# EasyEDA Pro project modern-cadet-v2.eprj, schematic Control board

## Sheets
1 Left Matrix: Board Name: Keyboard; Create Date: 2025-07-12; Page Name: Left Matrix; Project Name: modern-cadet-v2; Schematic Name: Control board; Update Date: 2025-07-12; Company: EasyEDA.com; Page Size: A4; Version: V1.0
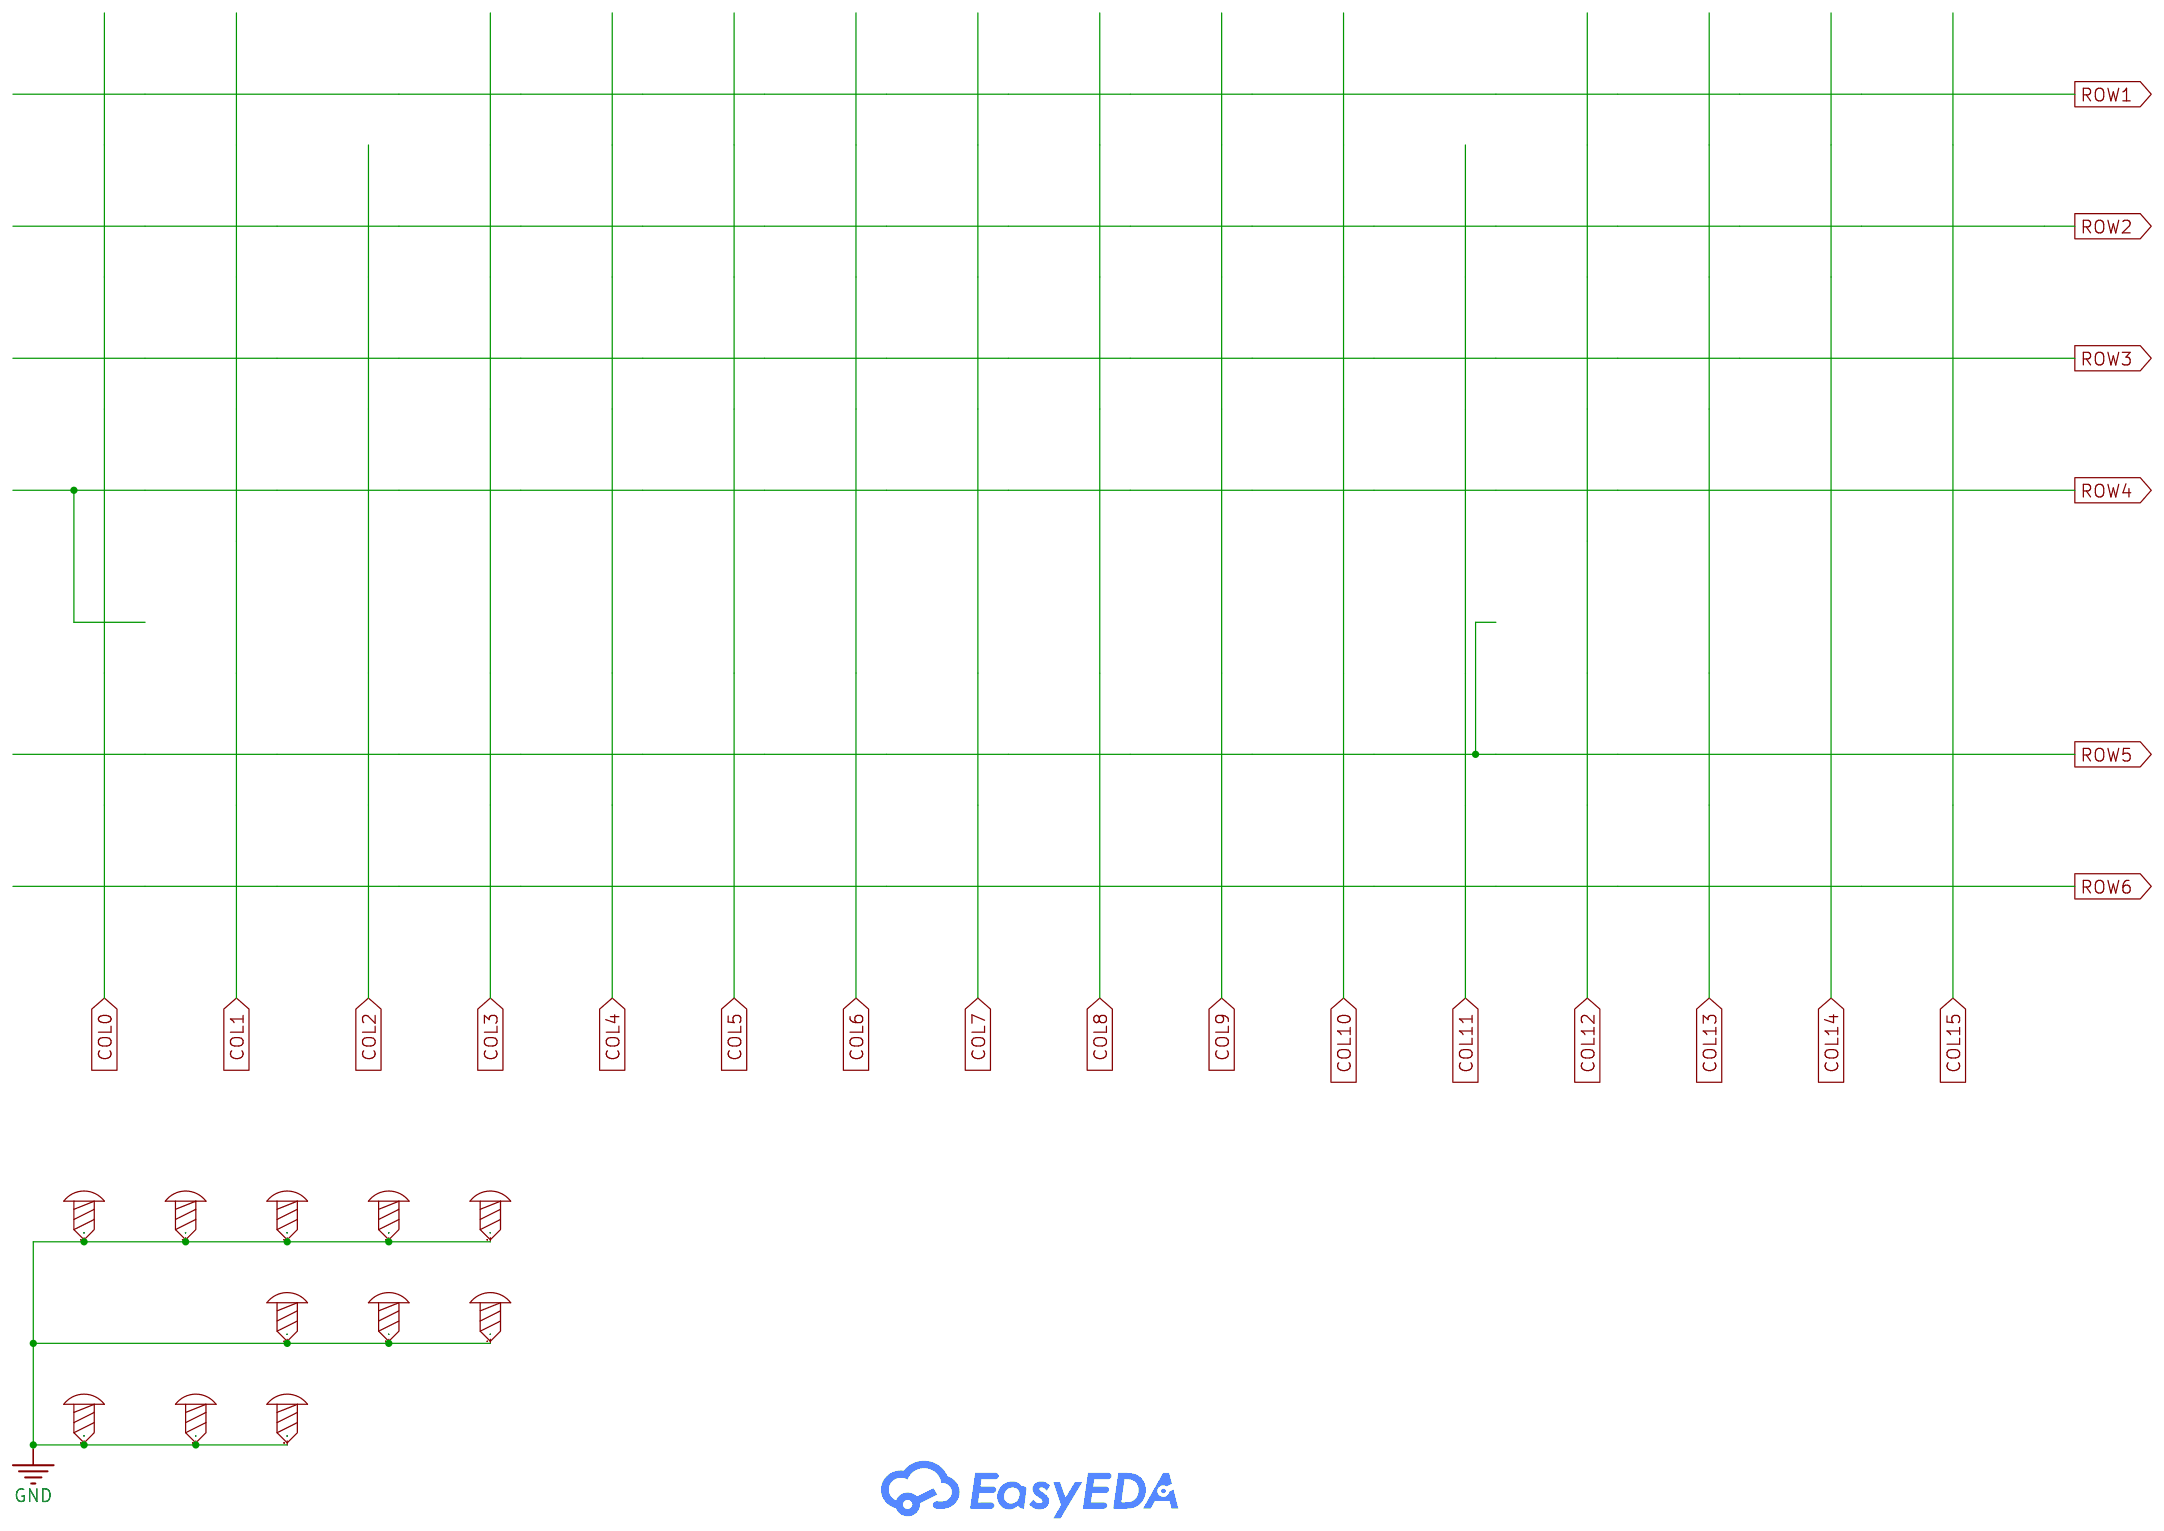
[diagram p0: Left Matrix]
2 Right Matrix: Page Name: Right Matrix
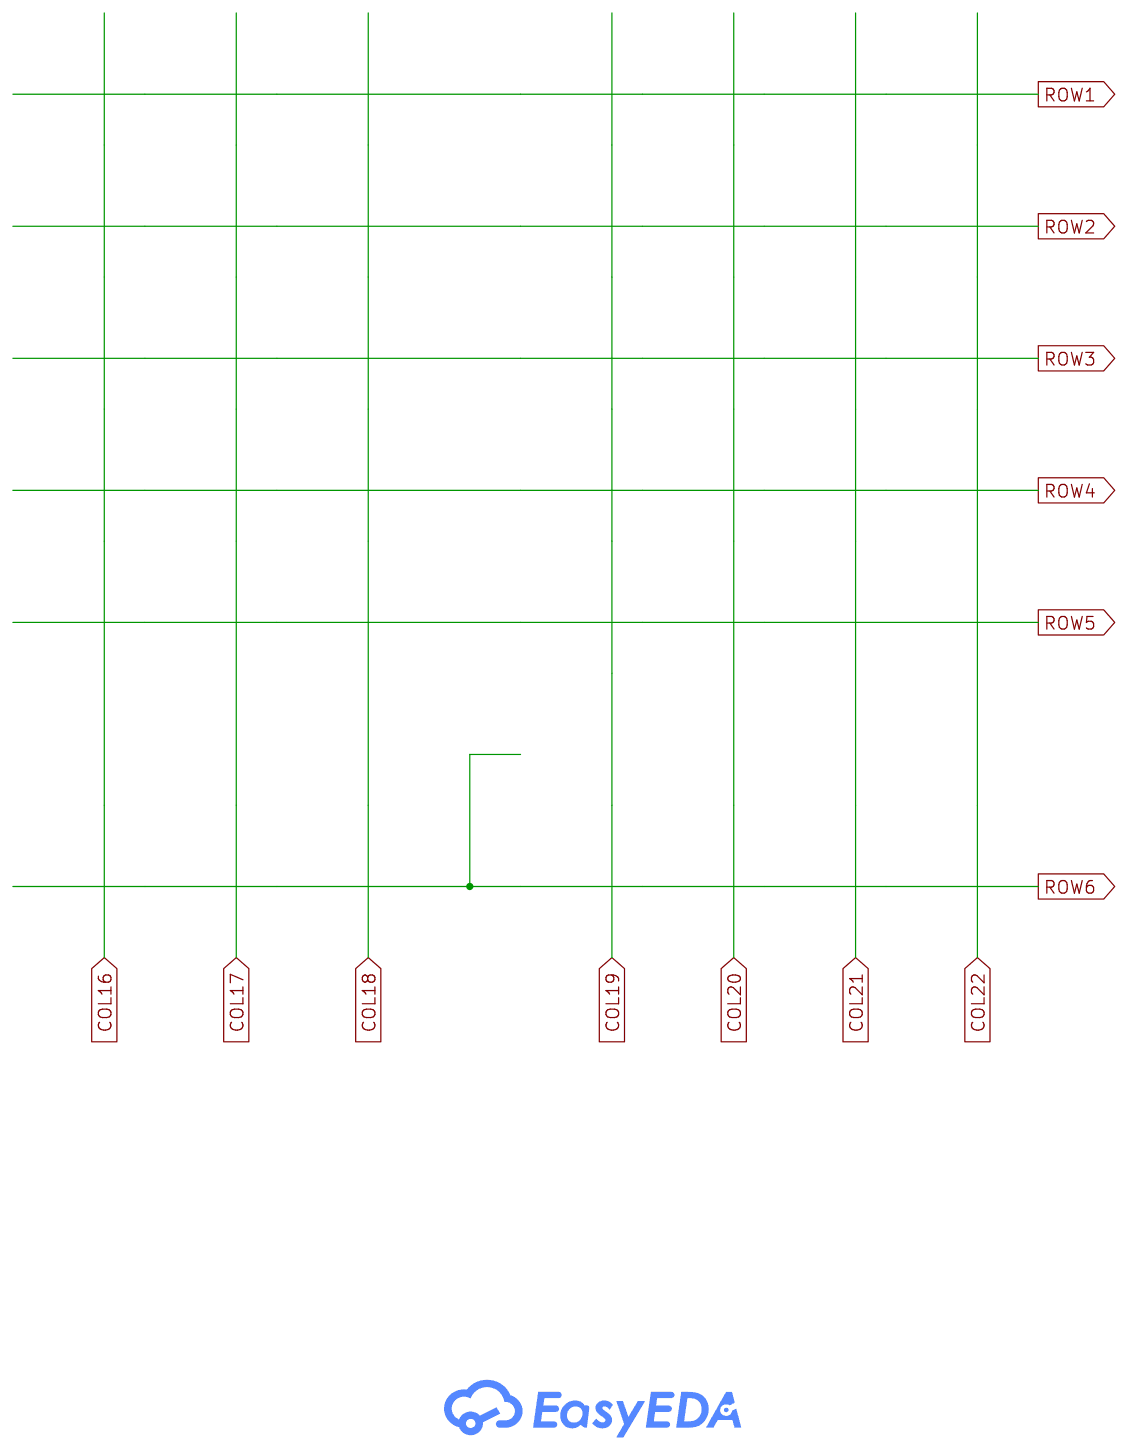
[diagram p1: Right Matrix]
3 Controller: Page Name: Controller
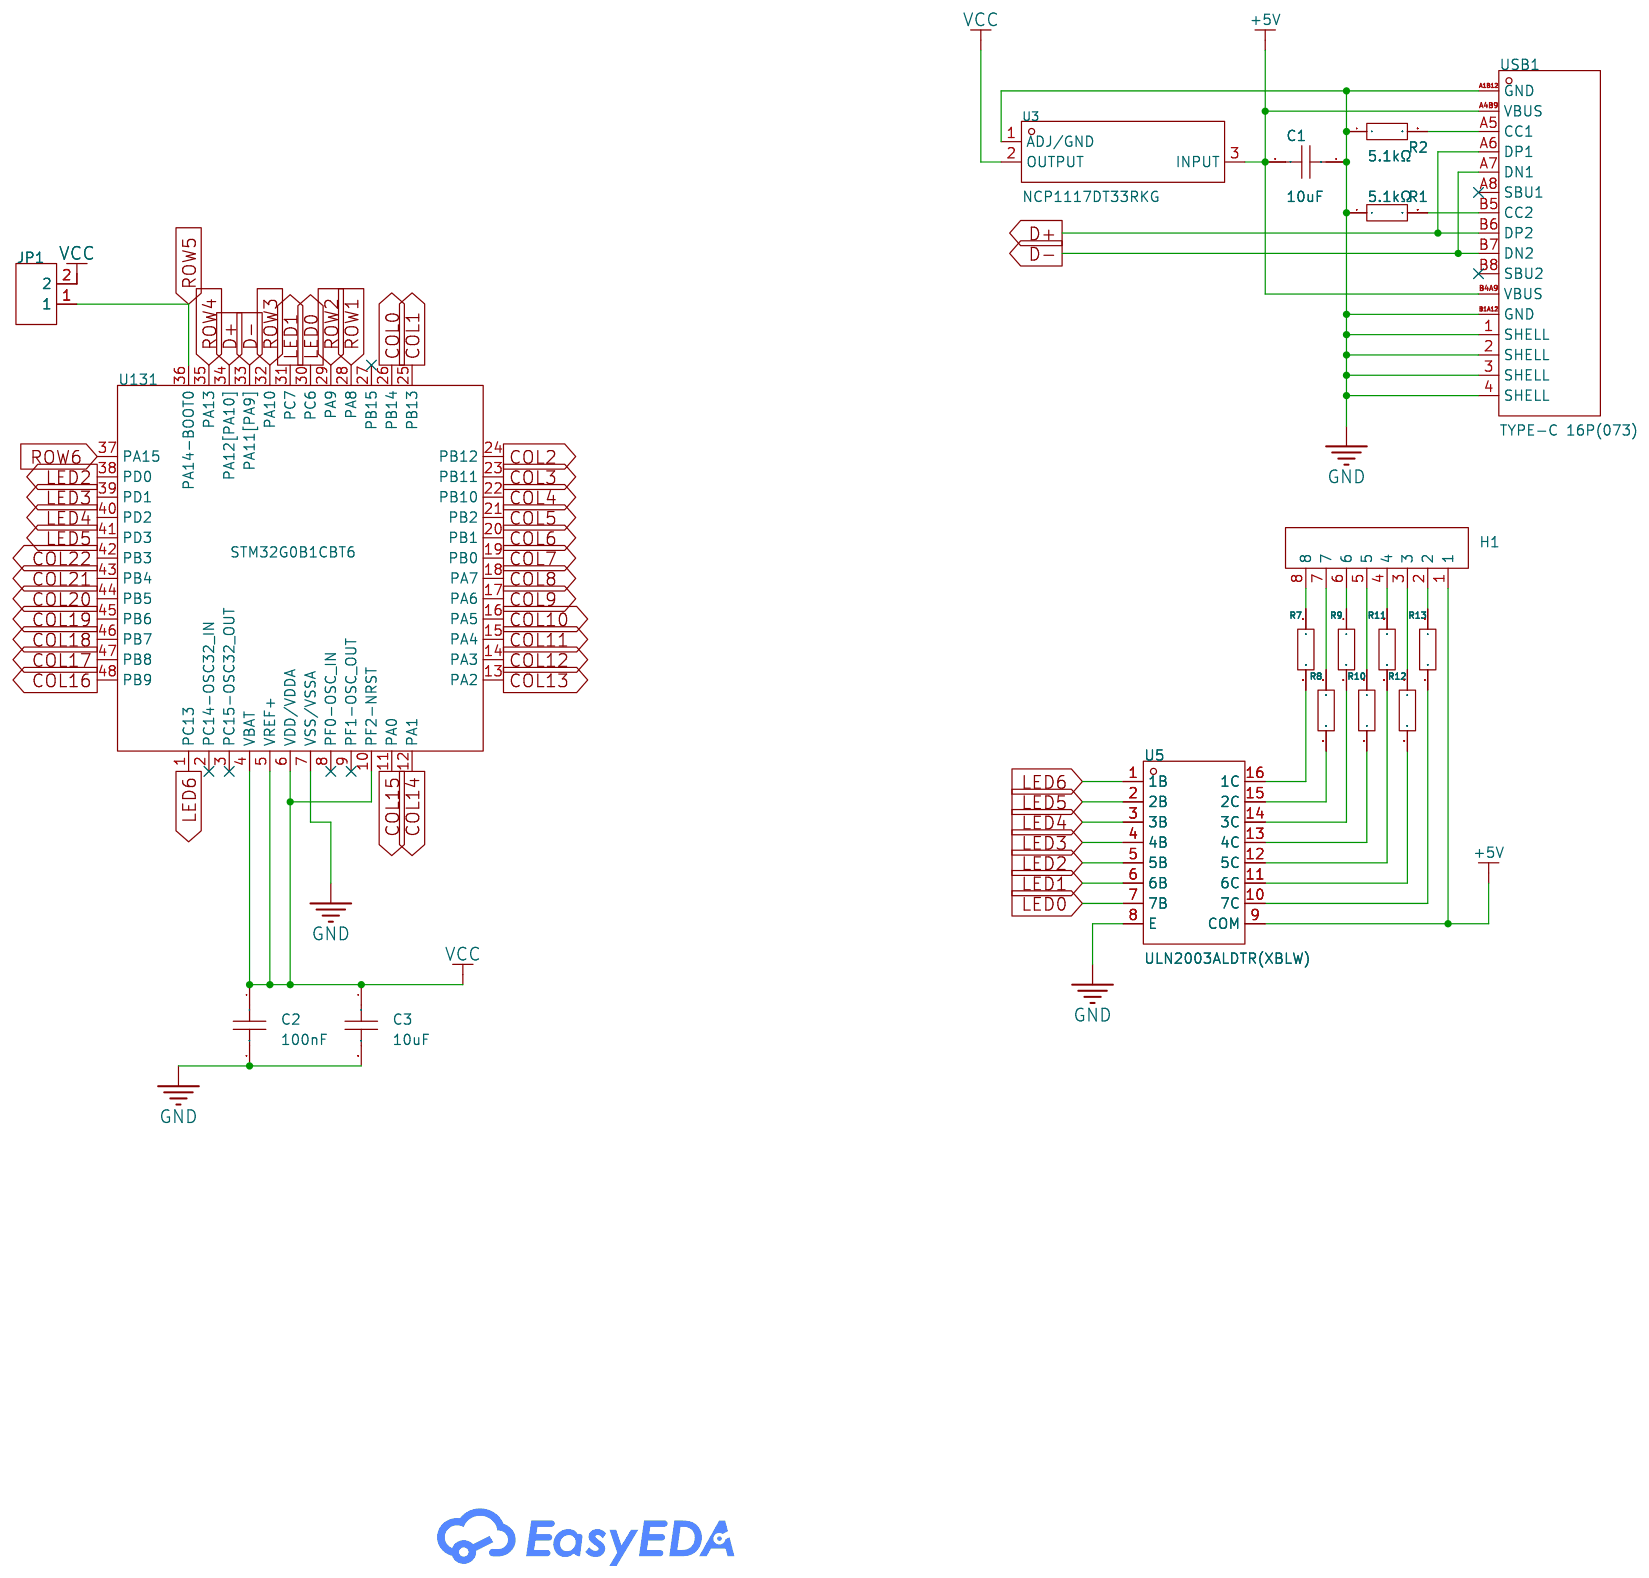
[diagram p2: Controller]

## Parts
sheet Controller
C1  10uF  [C0402]
C2  100nF  [C0402]
C3  10uF  [C0402]
H1  X6511WRS-08H-C60D48  [HDR-SMD_8P-P2.54-H-M-W13.3-N]
JP1  ZX-PZ1.0-1-2PWZ  [HDR-SMD_2P-P1.00-V-M-LS4.0]
R1  5.1kΩ  [R0402]
R2  5.1kΩ  [R0402]
R7  220Ω  [R0402]
R8  220Ω  [R0402]
R9  220Ω  [R0402]
R10  220Ω  [R0402]
R11  220Ω  [R0402]
R12  220Ω  [R0402]
R13  220Ω  [R0402]
U3  NCP1117DT33RKG  [TO-252-2_L6.6-W6.1-P4.57-LS9.9-TL-CW]
U5  ULN2003ALDTR(XBLW)  [SOP-16_L9.9-W3.9-P1.27-LS6.0-BL]
U131  STM32G0B1CBT6  [LQFP-48_L7.0-W7.0-P0.50-LS9.0-BL]
USB1  TYPE-C 16P(073)  [USB-C-SMD_TYPE-C16PIN_C668624]
sheet Left Matrix
K0  -
K1  -
K2  -
K3  -
K4  -
K5  -
K6  -
K7  -
K8  -
K9  -
KA  -
KALTGR  -
KB  -
KBAR  -
KBREAK  -
KBS  -
KC  -
KCLOCK  -
KCLOSE  -
KCMD  -
KCOMMA  -
KCOMPOSE  -
KD  -
KE  -
KESC  -
KEXTRA  -
KF  -
KF1  -
KF2  -
KF3  -
KF4  -
KF5  -
KF6  -
KF7  -
KF8  -
KF9  -
KF10  -
KF11  -
KF12  -
KFOCUS  -
KG  -
KH  -
KHYPER  -
KI  -
KJ  -
KK  -
KL  -
KLAYER2  -
KLCTRL  -
KLSHIFT  -
KM  -
KMENU  -
KMETA  -
KMINUS  -
KN  -
KO  -
KOPEN  -
KP  -
KPERIOD  -
KPLUS  -
KQ  -
KQUOTE  -
KR  -
KRCTRL  -
KRETURN  -
KRSHIFT  -
KRSPARE  -
KS  -
KSAK  -
KSBS  -
KSCLOCK  -
KSCREEN  -
KSEMI  -
KSLASH  -
KSPACE  -
KSRSHIFT  -
KSUPER  -
KT  -
KTAB  -
KTILDE  -
KU  -
KV  -
KW  -
KX  -
KY  -
KZ  -
SCREW1  -  [M4 screw]  (no BOM)
SCREW2  -  [M4 screw]  (no BOM)
SCREW3  -  [M4 screw]  (no BOM)
SCREW4  -  [M4 screw]  (no BOM)
SCREW5  -  [M4 screw]  (no BOM)
SCREW8  -  [M4 screw]  (no BOM)
SCREW9  -  [M4 screw]  (no BOM)
SCREW10  -  [M4 screw]  (no BOM)
SCREW11  -  [M4 screw]  (no BOM)
SCREW12  -  [M4 screw]  (no BOM)
SCREW13  -  [M4 screw]  (no BOM)
sheet Right Matrix
KALL  -
KDECIMAL  -
KDEL  -
KDOWN  -
KEND  -
KHOME  -
KINS  -
KLEFT  -
KM1  -
KM2  -
KNEXT  -
KNLOCK  -
KNP0  -
KNP00  -
KNP1  -
KNP2  -
KNP3  -
KNP4  -
KNP5  -
KNP6  -
KNP7  -
KNP8  -
KNP9  -
KNPA  -
KNPB  -
KNPC  -
KNPCOLON  -
KNPD  -
KNPE  -
KNPENTER  -
KNPF  -
KNPMINUS  -
KNPPLUS  -
KNPS0  -
KNPSLASH  -
KPAUSE  -
KPGDN  -
KPGUP  -
KPREV  -
KSLOCK  -
KUP  -
KUP1  -

## Library data of the parts
C1 C3 = CL05A106MQ5NUNC: Capacitance: Tolerance:±20% Tolerance:±20% Voltage Rated: Temperature Coefficient:; LCSC Part Name: 10uF ±20% 6.3V; Supplier Part: C15525; Manufacturer: SAMSUNG(三星); Supplier Footprint: 0402; JLCPCB Part Class: Basic Part; Datasheet: https://atta.szlcsc.com/upload/public/pdf/source/20220823/2B02EE04F8F211D38A52DCB16EB6BEBA.pdf; Supplier: LCSC; Tolerance: ±20%
C2 = CL05B104KO5NNNC: Capacitance: Tolerance:±10% Tolerance:±10% Voltage Rated: Temperature Coefficient:; LCSC Part Name: 100nF ±10% 16V; Supplier Part: C1525; Manufacturer: SAMSUNG(三星); Supplier Footprint: 0402; JLCPCB Part Class: Basic Part; Datasheet: https://atta.szlcsc.com/upload/public/pdf/source/20160218/1457707763339.pdf; Supplier: LCSC; Tolerance: ±10%
H1 = X6511WRS-08H-C60D48: Pin Structure:1x8P Pitch:2.54mm Row Spacing:2.54mm Circluar Pins/Square Pins:Policy Number of Rows:Single Row Number of Pins:8P Current Rating:3A Voltage Rating (Max):250V Length of Mating Pin:- Insulation Height:2.5mm Length of End Connection Pin:- Conta; LCSC Part Name: 1x8P 间距:2.54mm 方针; Supplier Part: C5242201; Manufacturer: XKB Connection(中国星坤); Supplier Footprint: SMD,P=2.54mm; JLCPCB Part Class: Extended Part; Datasheet: https://atta.szlcsc.com/upload/public/pdf/source/20221103/EADF72CF36CD96D511D8188ACEE72315.pdf; Supplier: LCSC; Pin Structure: 1x8P; Pitch: 2.54mm; Row Spacing: 2.54mm; Circluar Pins/Square Pins: Policy; Number of Rows: Single Row; Number of Pins: 8P; Current Rating: 3A; Voltage Rating (Max): 250V; Insulation Height: 2.5mm; Contact Material: Brass; Contact Plating: Gold; Operating Temperature: -40℃~+105℃; Color: Black
JP1 = ZX-PZ1.0-1-2PWZ: Pin Structure:1x2P Pitch:1mm Row Spacing:- Circluar Pins/Square Pins:Policy Mounting Type:Vertical welding Number of Rows:Single Row Number of Pins:2P Current Rating:0.75A Length of Mating Pin:2mm Insulation Height:1mm Contact Material:Brass Contact Plati; LCSC Part Name: 1x2P 间距:1mm 方针 立贴; Supplier Part: C41370715; Manufacturer: Megastar(兆星); Supplier Footprint: SMD,P=1mm(交错脚); JLCPCB Part Class: Extended Part; Datasheet: https://atta.szlcsc.com/upload/public/pdf/source/20240828/533383694443DB49D9BA6A792B968A1B.pdf; Supplier: LCSC; Pin Structure: 1x2P; Pitch: 1mm; Circluar Pins/Square Pins: Policy; Mounting Type: Vertical welding; Number of Rows: Single Row; Number of Pins: 2P; Current Rating: 0.75A; Length of Mating Pin: 2mm; Insulation Height: 1mm; Contact Material: Brass; Contact Plating: Gold; Operating Temperature: -40℃~+105℃; Color: Black
R1 R2 = 0402WGF5101TCE: Type:Thick Film Resistors Resistance:5.1kΩ Tolerance:±1% Tolerance:±1% Power(Watts): Overload Voltage (Max): Temperature Coefficient:±100ppm/℃ Temperature Coefficient:±100ppm/℃ Operating Temperature Range:-55℃~+155℃ Operating Temperature Range:-55℃~+155℃; LCSC Part Name: 5.1kΩ ±1% 62.5mW 厚膜电阻; Supplier Part: C25905; Manufacturer: UNI-ROYAL(厚声); Supplier Footprint: 0402; JLCPCB Part Class: Basic Part; Datasheet: https://atta.szlcsc.com/upload/public/pdf/source/20200306/C422600_1E6D84923E4A46A82E41ADD87F860B5C.pdf; Supplier: LCSC; Type: Thick Film Resistors; Tolerance: ±1%; Temperature Coefficient: ±100ppm/℃; Operating Temperature Range: -55℃~+155℃
R7-R13 = 0402WGF2200TCE: Type:Thick Film Resistors Resistance: Tolerance:±1% Tolerance:±1% Power(Watts): Overload Voltage (Max): Temperature Coefficient:±100ppm/℃ Temperature Coefficient:±100ppm/℃ Operating Temperature Range:-55℃~+155℃ Operating Temperature Range:-55℃~+155℃; LCSC Part Name: 220Ω ±1% 62.5mW 厚膜电阻; Supplier Part: C25091; Manufacturer: UNI-ROYAL(厚声); Supplier Footprint: 0402; JLCPCB Part Class: Basic Part; Datasheet: https://atta.szlcsc.com/upload/public/pdf/source/20200306/C422600_1E6D84923E4A46A82E41ADD87F860B5C.pdf; Supplier: LCSC; Type: Thick Film Resistors; Tolerance: ±1%; Temperature Coefficient: ±100ppm/℃; Operating Temperature Range: -55℃~+155℃
U3 = NCP1117DT33RKG: Output Type: Maximum Input Voltage:20V Output Voltage:3.3V Output Voltage:3.3V MAX Output Current:1A Power Supply Rejection Ratio (PSRR):64dB@(120Hz) Dropout Voltage:1.2V@(800mA) standby current:10mA Operating Temperature:0℃~+125℃ Operating Temperature:0℃; LCSC Part Name: 输入20V 输出3.3V 1A; Supplier Part: C88234; Manufacturer: onsemi(安森美); Supplier Footprint: TO-252-2(DPAK); JLCPCB Part Class: Extended Part; Datasheet: https://atta.szlcsc.com/upload/public/pdf/source/20180713/C233237_751C9E9ABCFEB70C62A2D3109B40BDA0.pdf; Supplier: LCSC; Maximum Input Voltage: 20V; Output Voltage: 3.3V; MAX Output Current: 1A; Power Supply Rejection Ratio (PSRR): 64dB@(120Hz); Dropout Voltage: 1.2V@(800mA); standby current: 10mA; Operating Temperature: 0℃~+125℃; Output Polarity: Positive electrode; Number of Outputs: 1
U5 = ULN2003ALDTR(XBLW): number of channels:Seven channels Maximum collector Emitter Voltage (Vceo):50V Collector Current(Ic):500mA maximum input voltage:30V Operating Temperature:-40℃~+85℃ Operating Temperature:-40℃~+85℃; Supplier Part: C22387044; Manufacturer: XBLW(芯伯乐); Supplier Footprint: SOP-16; JLCPCB Part Class: Extended Part; Datasheet: https://atta.szlcsc.com/upload/public/pdf/source/20240422/8413B693242B110A4D0F33891E36DA33.pdf; Supplier: LCSC; number of channels: Seven channels; Maximum collector Emitter Voltage (Vceo): 50V; Collector Current(Ic): 500mA; maximum input voltage: 30V; Operating Temperature: -40℃~+85℃
U131 = STM32G0B1CBT6: LCSC Part Name: 主流Arm Cortex-M0+ 32位MCU，最高128KB闪存，144KB内存，6个USART，定时器，ADC，DAC，通信接口，1.7-3.6V; Supplier Part: C2847904; Manufacturer: ST(意法半导体); Supplier Footprint: LQFP-48(7x7); JLCPCB Part Class: Extended Part; Datasheet: https://atta.szlcsc.com/upload/public/pdf/source/20210707/C2829307_30DFBC3FA791244241E64BDE5F705BBC.pdf; Supplier: LCSC; CPU Core: ARM-MSeries
USB1 = TYPE-C 16P(073): Connector Type:Type-C Standard:USB 3.1 Gender:Female Mounting Style:Horizontal attachment Number of Contacts:16P Number of Ports:1 Current Rating - Power (Max):5A Operating Temperature Range:-25℃~+85℃ Operating Temperature Range:-25℃~+85℃ Rated Voltage (M; LCSC Part Name: Type-C 母 卧贴; Supplier Part: C668624; Manufacturer: SHOU HAN(首韩); Supplier Footprint: SMD; JLCPCB Part Class: Extended Part; Datasheet: https://atta.szlcsc.com/upload/public/pdf/source/20200618/C668624_CC51EC37614090AAD56C1421DE954C80.pdf; Supplier: LCSC; Connector Type: Type-C; Standard: USB 3.1; Gender: Female; Mounting Style: Horizontal attachment; Number of Contacts: 16P; Number of Ports: 1; Current Rating - Power (Max): 5A; Operating Temperature Range: -25℃~+85℃; Rated Voltage (Max): 5V; Connect-Disconnect Life: 10,000 times; Core Colour: Black
SCREW1-SCREW5 SCREW8-SCREW13 = M4 screw: Check: false

## Nets
+5V: C1.2 H1.1 U3.3(INPUT) U5.9(COM) USB1.A4B9(VBUS) USB1.B4A9(VBUS)
GND: C1.1 C2.2 C3.2 R1.1 R2.1 SCREW1.1 SCREW2.1 SCREW3.1 SCREW4.1 SCREW5.1 SCREW8.1 SCREW9.1 SCREW10.1 SCREW11.1 SCREW12.1 SCREW13.1 U3.1(ADJ/GND) U5.8(E) U131.7(VSS/VSSA) USB1.1(SHELL) USB1.2(SHELL) USB1.3(SHELL) USB1.4(SHELL) USB1.A1B12(GND) USB1.B1A12(GND)
VCC: C2.1 C3.1 JP1.2 U3.2(OUTPUT) U131.4(VBAT) U131.5(VREF+) U131.6(VDD/VDDA) U131.10(PF2-NRST)
COL0: U131.26(PB14)
COL1: U131.25(PB13)
COL2: U131.24(PB12)
COL3: U131.23(PB11)
COL4: U131.22(PB10)
COL5: U131.21(PB2)
COL6: U131.20(PB1)
COL7: U131.19(PB0)
COL8: U131.18(PA7)
COL9: U131.17(PA6)
COL10: U131.16(PA5)
COL11: U131.15(PA4)
COL12: U131.14(PA3)
COL13: U131.13(PA2)
COL14: U131.12(PA1)
COL15: U131.11(PA0)
COL16: U131.48(PB9)
COL17: U131.47(PB8)
COL18: U131.46(PB7)
COL19: U131.45(PB6)
COL20: U131.44(PB5)
COL21: U131.43(PB4)
COL22: U131.42(PB3)
D+: U131.34(PA12[PA10]) USB1.A6(DP1) USB1.B6(DP2)
D-: U131.33(PA11[PA9]) USB1.A7(DN1) USB1.B7(DN2)
LED0: U5.7(7B) U131.30(PC6)
LED1: U5.6(6B) U131.31(PC7)
LED2: U5.5(5B) U131.38(PD0)
LED3: U5.4(4B) U131.39(PD1)
LED4: U5.3(3B) U131.40(PD2)
LED5: U5.2(2B) U131.41(PD3)
LED6: U5.1(1B) U131.1(PC13)
ROW1: U131.28(PA8)
ROW2: U131.29(PA9)
ROW3: U131.32(PA10)
ROW4: U131.35(PA13)
ROW5: JP1.1 U131.36(PA14-BOOT0)
ROW6: U131.37(PA15)
$3N1762: R2.2 USB1.A5(CC1)
$3N1766: R1.2 USB1.B5(CC2)
$3N5027: R7.2 U5.16(1C)
$3N5032: R8.2 U5.15(2C)
$3N5038: R9.2 U5.14(3C)
$3N5044: R10.2 U5.13(4C)
$3N5050: R11.2 U5.12(5C)
$3N5056: R12.2 U5.11(6C)
$3N6143: H1.8 R7.1
$3N6155: H1.7 R8.1
$3N6167: H1.6 R9.1
$3N6179: H1.5 R10.1
$3N6191: H1.4 R11.1
$3N6204: H1.3 R12.1
$3N6209: R13.2 U5.10(7C)
$3N6215: H1.2 R13.1

Not connected (* = marked no-connect by the designer): K0 C(COL) R(ROW); K1 C(COL) R(ROW); K2 C(COL) R(ROW); K3 C(COL) R(ROW); K4 C(COL) R(ROW); K5 C(COL) R(ROW); K6 C(COL) R(ROW); K7 C(COL) R(ROW); K8 C(COL) R(ROW); K9 C(COL) R(ROW); KA C(COL) R(ROW); KALL C(COL) R(ROW); KALTGR C(COL) R(ROW); KB C(COL) R(ROW); KBAR C(COL) R(ROW); KBREAK C(COL) R(ROW); KBS C(COL) R(ROW); KC C(COL) R(ROW); KCLOCK C(COL) R(ROW); KCLOSE C(COL) R(ROW); KCMD C(COL) R(ROW); KCOMMA C(COL) R(ROW); KCOMPOSE C(COL) R(ROW); KD C(COL) R(ROW); KDECIMAL C(COL) R(ROW); KDEL C(COL) R(ROW); KDOWN C(COL) R(ROW); KE C(COL) R(ROW); KEND C(COL) R(ROW); KESC C(COL) R(ROW); KEXTRA C(COL) R(ROW); KF C(COL) R(ROW); KF1 C(COL) R(ROW); KF2 C(COL) R(ROW); KF3 C(COL) R(ROW); KF4 C(COL) R(ROW); KF5 C(COL) R(ROW); KF6 C(COL) R(ROW); KF7 C(COL) R(ROW); KF8 C(COL) R(ROW); KF9 C(COL) R(ROW); KF10 C(COL) R(ROW); KF11 C(COL) R(ROW); KF12 C(COL) R(ROW); KFOCUS C(COL) R(ROW); KG C(COL) R(ROW); KH C(COL) R(ROW); KHOME C(COL) R(ROW); KHYPER C(COL) R(ROW); KI C(COL) R(ROW); KINS C(COL) R(ROW); KJ C(COL) R(ROW); KK C(COL) R(ROW); KL C(COL) R(ROW); KLAYER2 C(COL) R(ROW); KLCTRL C(COL) R(ROW); KLEFT C(COL) R(ROW); KLSHIFT C(COL) R(ROW); KM C(COL) R(ROW); KM1 C(COL) R(ROW); KM2 C(COL) R(ROW); KMENU C(COL) R(ROW); KMETA C(COL) R(ROW); KMINUS C(COL) R(ROW); KN C(COL) R(ROW); KNEXT C(COL) R(ROW); KNLOCK C(COL) R(ROW); KNP0 C(COL) R(ROW); KNP00 C(COL) R(ROW); KNP1 C(COL) R(ROW); KNP2 C(COL) R(ROW); KNP3 C(COL) R(ROW); KNP4 C(COL) R(ROW); KNP5 C(COL) R(ROW); KNP6 C(COL) R(ROW); KNP7 C(COL) R(ROW); KNP8 C(COL) R(ROW); KNP9 C(COL) R(ROW); KNPA C(COL) R(ROW); KNPB C(COL) R(ROW); KNPC C(COL) R(ROW); KNPCOLON C(COL) R(ROW); KNPD C(COL) R(ROW); KNPE C(COL) R(ROW); KNPENTER C(COL) R(ROW); KNPF C(COL) R(ROW); KNPMINUS C(COL) R(ROW); KNPPLUS C(COL) R(ROW); KNPS0 C(COL) R(ROW); KNPSLASH C(COL) R(ROW); KO C(COL) R(ROW); KOPEN C(COL) R(ROW); KP C(COL) R(ROW); KPAUSE C(COL) R(ROW); KPERIOD C(COL) R(ROW); KPGDN C(COL) R(ROW); KPGUP C(COL) R(ROW); KPLUS C(COL) R(ROW); KPREV C(COL) R(ROW); KQ C(COL) R(ROW); KQUOTE C(COL) R(ROW); KR C(COL) R(ROW); KRCTRL C(COL) R(ROW); KRETURN C(COL) R(ROW); KRSHIFT C(COL) R(ROW); KRSPARE C(COL) R(ROW); KS C(COL) R(ROW); KSAK C(COL) R(ROW); KSBS C(COL) R(ROW); KSCLOCK C(COL) R(ROW); KSCREEN C(COL) R(ROW); KSEMI C(COL) R(ROW); KSLASH C(COL) R(ROW); KSLOCK C(COL) R(ROW); KSPACE C(COL) R(ROW); KSRSHIFT C(COL) R(ROW); KSUPER C(COL) R(ROW); KT C(COL) R(ROW); KTAB C(COL) R(ROW); KTILDE C(COL) R(ROW); KU C(COL) R(ROW); KUP C(COL) R(ROW); KUP1 C(COL) R(ROW); KV C(COL) R(ROW); KW C(COL) R(ROW); KX C(COL) R(ROW); KY C(COL) R(ROW); KZ C(COL) R(ROW); U131 2(PC14-OSC32_IN)* 3(PC15-OSC32_OUT)* 8(PF0-OSC_IN)* 9(PF1-OSC_OUT)* 27(PB15)*; USB1 A8(SBU1)* B8(SBU2)*
